# Altium schematic sheet Main Board CAN Modules.SchDoc
size A; SheetNumber: 2; SheetTotal: 3
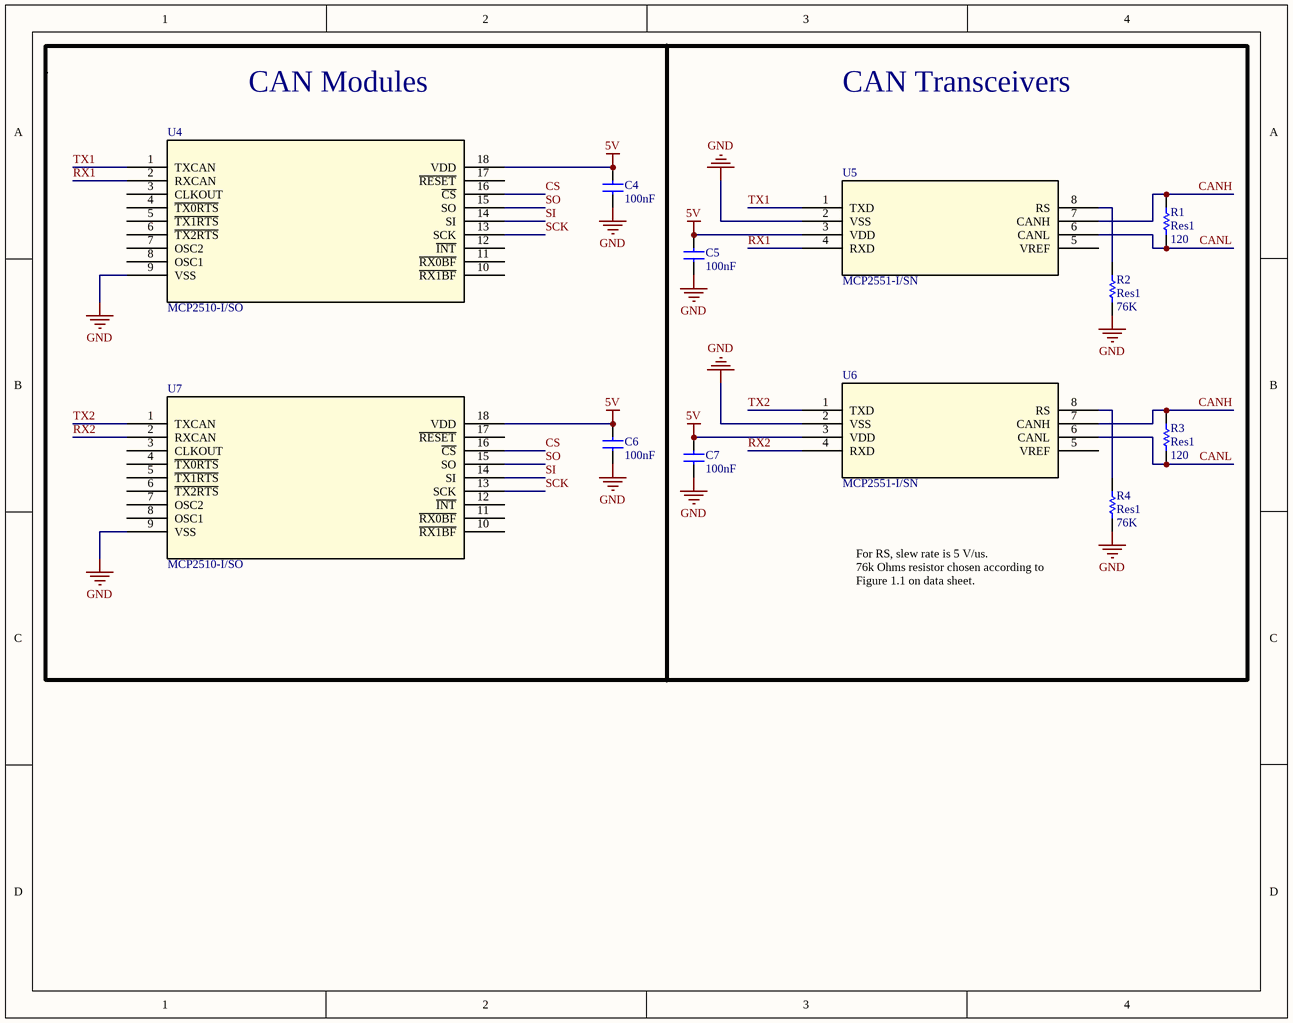
[diagram p0: Main Board CAN Modules.SchDoc]

## Parts
C4  value 100nF  [CAPC0603]  (hidden comment: Cap)
C5  value 100nF  [CAPC0603]  (hidden comment: Cap)
C6  value 100nF  [CAPC0603]  (hidden comment: Cap)
C7  value 100nF  [CAPC0603]  (hidden comment: Cap)
R1  Res1  value 120  [AXIAL-0.3]
R2  Res1  value 76K  [AXIAL-0.3]
R3  Res1  value 120  [AXIAL-0.3]
R4  Res1  value 76K  [AXIAL-0.3]
U4  MCP2510-I/SO  [SOIC18-W_MC_MCH]
U5  MCP2551-I/SN  [SOIC8-N_MC_MCH]
U6  MCP2551-I/SN  [SOIC8-N_MC_MCH]
U7  MCP2510-I/SO  [SOIC18-W_MC_MCH]

## Blocks framed on the sheet
CAN Modules: C4 C6 U4 U7

## Nets
5V: C4.1(A) C5.1(A) C6.1(A) C7.1(A) U4.18(VDD) U5.3(VDD) U6.3(VDD) U7.18(VDD)
GND: C4.2(B) C5.2(B) C6.2(B) C7.2(B) R2.2 R4.2 U4.9(VSS) U5.2(VSS) U6.2(VSS) U7.9(VSS)
CANH: R1.2 R3.2 U5.7(CANH) U6.7(CANH)
CANL: R1.1 R3.1 U5.6(CANL) U6.6(CANL)
CS: U4.16(~{CS}) U7.16(~{CS})
RX1: U4.2(RXCAN) U5.4(RXD)
RX2: U6.4(RXD) U7.2(RXCAN)
SCK: U4.13(SCK) U7.13(SCK)
SI: U4.14(SI) U7.14(SI)
SO: U4.15(SO) U7.15(SO)
TX1: U4.1(TXCAN) U5.1(TXD)
TX2: U6.1(TXD) U7.1(TXCAN)
NetR2_1: R2.1 U5.8(RS)
NetR4_1: R4.1 U6.8(RS)

Not connected (* = marked no-connect by the designer): U4 3(CLKOUT) 4(~{TX0RTS}) 5(~{TX1RTS}) 6(~{TX2RTS}) 7(OSC2) 8(OSC1) 10(~{RX1BF}) 11(~{RX0BF}) 12(~{INT}) 17(~{RESET}); U5 5(VREF); U6 5(VREF); U7 3(CLKOUT) 4(~{TX0RTS}) 5(~{TX1RTS}) 6(~{TX2RTS}) 7(OSC2) 8(OSC1) 10(~{RX1BF}) 11(~{RX0BF}) 12(~{INT}) 17(~{RESET})

## Notes on the sheet
- CAN Transceivers
- For RS, slew rate is 5 V/us.
  76k Ohms resistor chosen according to Figure 1.1 on data sheet.

## Library data of the parts
R1-R4 = Res1: Resistor; Published: 8-Jun-2000; LatestRevisionDate: 17-Jul-2002; LatestRevisionNote: Re-released for DXP Platform.; PackageReference: AXIAL-0.3; Publisher: Altium Limited; PackageDescription: Axial Device, Thru-Hole; 2 Leads; 0.3 in Pin Spacing
U4 U7 = MCP2510-I/SO: No Description Available; Mfr_Name: Microchip; RefDes: RefDes; Type: Type
U5 U6 = MCP2551-I/SN: No Description Available; Mfr_Name: Microchip; RefDes: RefDes; Type: Type
C4-C7 = Cap: Supplier 1: Digi-Key; Supplier Part Number 1: 1276-1000-1-ND